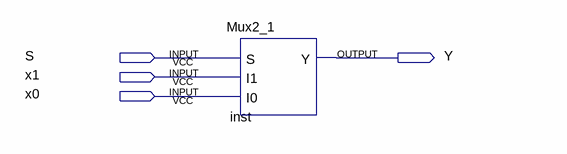
[diagram p0: schematic sheet]
// Quartus schematic MuxDemo.bdf as structural Verilog: 1 symbols, 4 pins
module MuxDemo (
  input  S,
  input  x1,
  input  x0,
  output Y
);

  Mux2_1 inst (.S(S), .I1(x1), .I0(x0), .Y(Y));
endmodule
